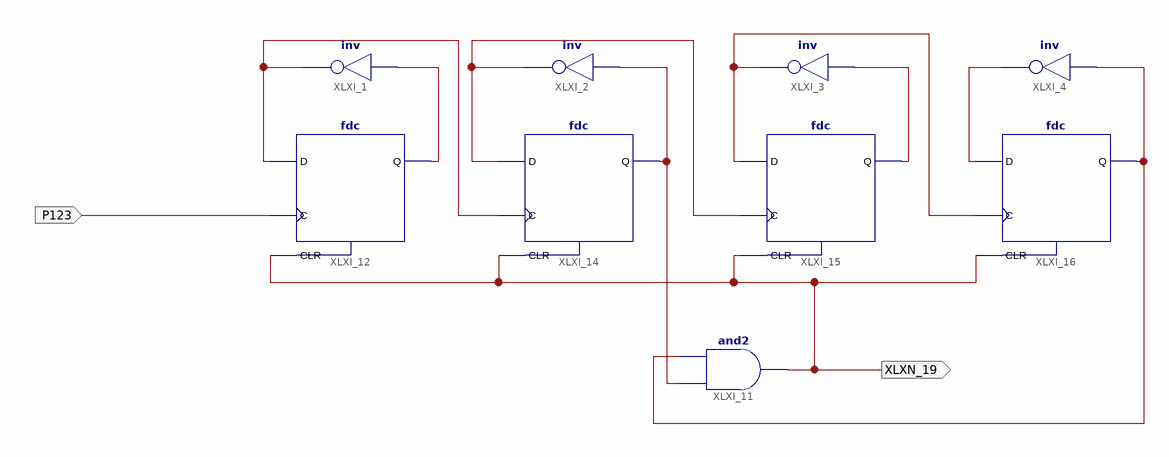
[diagram p0: schematic sheet 1]
// Xilinx ISE schematic mod10.sch (spartan6) as structural Verilog: 9 symbols, 3 ports
module mod10 (
  input  P123,
  output XLXN_8,
  output XLXN_19
);

  wire XLXN_1, XLXN_2, XLXN_3, XLXN_4, XLXN_5, XLXN_6, XLXN_9;

  not XLXI_1 (XLXN_9, XLXN_1);
  not XLXI_2 (XLXN_2, XLXN_3);
  not XLXI_3 (XLXN_4, XLXN_5);
  not XLXI_4 (XLXN_6, XLXN_8);
  and XLXI_11 (XLXN_19, XLXN_3, XLXN_8);
  fdc XLXI_12 (.C(P123), .CLR(XLXN_19), .D(XLXN_9), .Q(XLXN_1));
  fdc XLXI_14 (.C(XLXN_9), .CLR(XLXN_19), .D(XLXN_2), .Q(XLXN_3));
  fdc XLXI_15 (.C(XLXN_2), .CLR(XLXN_19), .D(XLXN_4), .Q(XLXN_5));
  fdc XLXI_16 (.C(XLXN_4), .CLR(XLXN_19), .D(XLXN_6), .Q(XLXN_8));
endmodule
